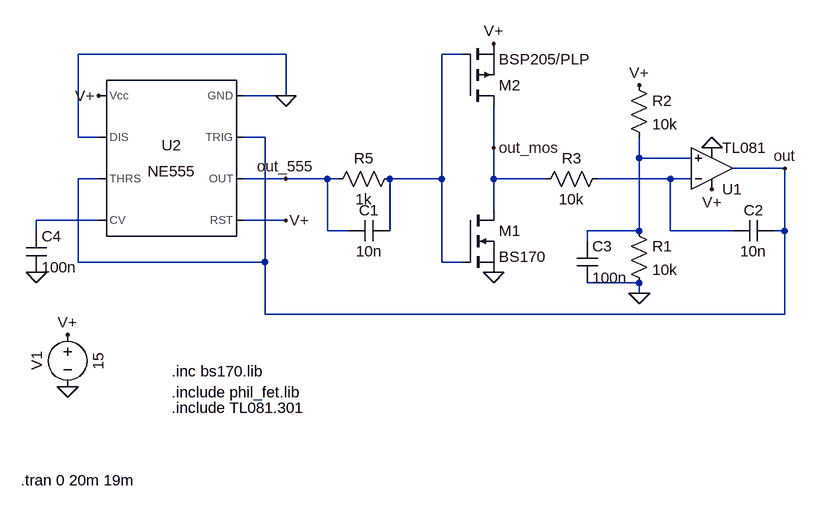
[diagram p0: schematic Circuito_basico_555.asc]
Circuito_basico_555.asc, the LTspice schematic file:
Version 4
SHEET 1 1596 768
WIRE -528 96 -848 96
WIRE -256 96 -288 96
WIRE -528 160 -528 96
WIRE -528 160 -592 160
WIRE -848 224 -848 96
WIRE -816 224 -848 224
WIRE -560 224 -592 224
WIRE -208 240 -208 176
WIRE 16 256 16 224
WIRE 96 256 16 256
WIRE 240 272 160 272
WIRE -816 288 -848 288
WIRE -528 288 -592 288
WIRE -464 288 -528 288
WIRE -448 288 -464 288
WIRE -288 288 -288 96
WIRE -288 288 -368 288
WIRE -208 288 -208 240
WIRE -128 288 -208 288
WIRE 64 288 -48 288
WIRE 96 288 64 288
WIRE -208 336 -208 288
WIRE -816 352 -912 352
WIRE -528 352 -592 352
WIRE -912 368 -912 352
WIRE -464 368 -464 288
WIRE -432 368 -464 368
WIRE -368 368 -368 288
WIRE 16 368 16 256
WIRE 16 368 -64 368
WIRE 64 368 64 288
WIRE 160 368 64 368
WIRE 240 368 240 272
WIRE 240 368 224 368
WIRE -64 384 -64 368
WIRE -848 416 -848 288
WIRE -560 416 -560 224
WIRE -560 416 -848 416
WIRE -288 416 -288 288
WIRE -256 416 -288 416
WIRE 16 448 -64 448
WIRE 16 464 16 448
WIRE -560 496 -560 416
WIRE 240 496 240 368
WIRE 240 496 -560 496
FLAG 16 464 0
FLAG 128 240 0
FLAG -528 352 V+
FLAG -208 80 V+
FLAG 16 144 V+
FLAG 128 304 V+
FLAG -208 432 0
FLAG -528 160 0
FLAG -816 160 V+
FLAG -912 432 0
FLAG -864 528 V+
FLAG -864 608 0
FLAG -208 240 out_mos
FLAG -528 288 out_555
FLAG 240 272 out
SYMBOL Opamps\\opamp2 128 336 M180
SYMATTR InstName U1
SYMATTR Value TL081
SYMBOL res 0 352 R0
SYMATTR InstName R1
SYMATTR Value 10k
SYMBOL res 0 128 R0
SYMATTR InstName R2
SYMATTR Value 10k
SYMBOL res -32 272 R90
WINDOW 0 0 56 VBottom 2
WINDOW 3 32 56 VTop 2
SYMATTR InstName R3
SYMATTR Value 10k
SYMBOL res -352 272 R90
WINDOW 0 0 56 VBottom 2
WINDOW 3 32 56 VTop 2
SYMATTR InstName R5
SYMATTR Value 1k
SYMBOL cap -368 352 R90
WINDOW 0 0 32 VBottom 2
WINDOW 3 32 32 VTop 2
SYMATTR InstName C1
SYMATTR Value 10n
SYMBOL cap 224 352 R90
WINDOW 0 0 32 VBottom 2
WINDOW 3 32 32 VTop 2
SYMATTR InstName C2
SYMATTR Value 10n
SYMBOL cap -80 384 R0
SYMATTR InstName C3
SYMATTR Value 100n
SYMBOL nmos -256 336 R0
SYMATTR InstName M1
SYMATTR Value BS170
SYMATTR Prefix X
SYMBOL pmos -256 176 M180
SYMATTR InstName M2
SYMATTR Value BSP205/PLP
SYMATTR Prefix X
SYMBOL Misc\\NE555 -704 256 M0
SYMATTR InstName U2
SYMBOL cap -928 368 R0
SYMATTR InstName C4
SYMATTR Value 100n
SYMBOL voltage -864 512 R0
WINDOW 0 -32 56 VBottom 2
WINDOW 3 32 56 VTop 2
WINDOW 123 0 0 Left 0
WINDOW 39 0 0 Left 0
SYMATTR InstName V1
SYMATTR Value 15
TEXT -704 640 Left 2 !.include TL081.301
TEXT -936 752 Left 2 !.tran 0 20m 19m
TEXT -704 616 Left 2 !.include phil_fet.lib
TEXT -704 584 Left 2 !.inc bs170.lib

The netlist it stands for:
* Circuito_basico_555.asc
XU1 N002 N003 V+ 0 out TL081  ; pins In+ In- V+ V- OUT
R1 N002 0 10k
R2 V+ N002 10k
R3 N003 out_mos 10k
R5 N001 out_555 1k
C1 N001 out_555 10n
C2 out N003 10n
C3 N002 0 100n
XM1 out_mos N001 0 BS170  ; pins D G S
XM2 out_mos N001 V+ BSP205/PLP  ; pins D G S
XU2 0 out out_555 V+ N004 out 0 V+ NE555  ; pins GND TRIG OUT RST CV THRS DIS Vcc
C4 N004 0 100n
V1 V+ 0 15
.include TL081.301
.tran 0 20m 19m
.include phil_fet.lib
.inc bs170.lib
.lib NE555.sub
.backanno
.end